# Altium schematic sheet MCU.SchDoc
size A3; DocumentNumber: 3; SheetNumber: 1; SheetTotal: 5
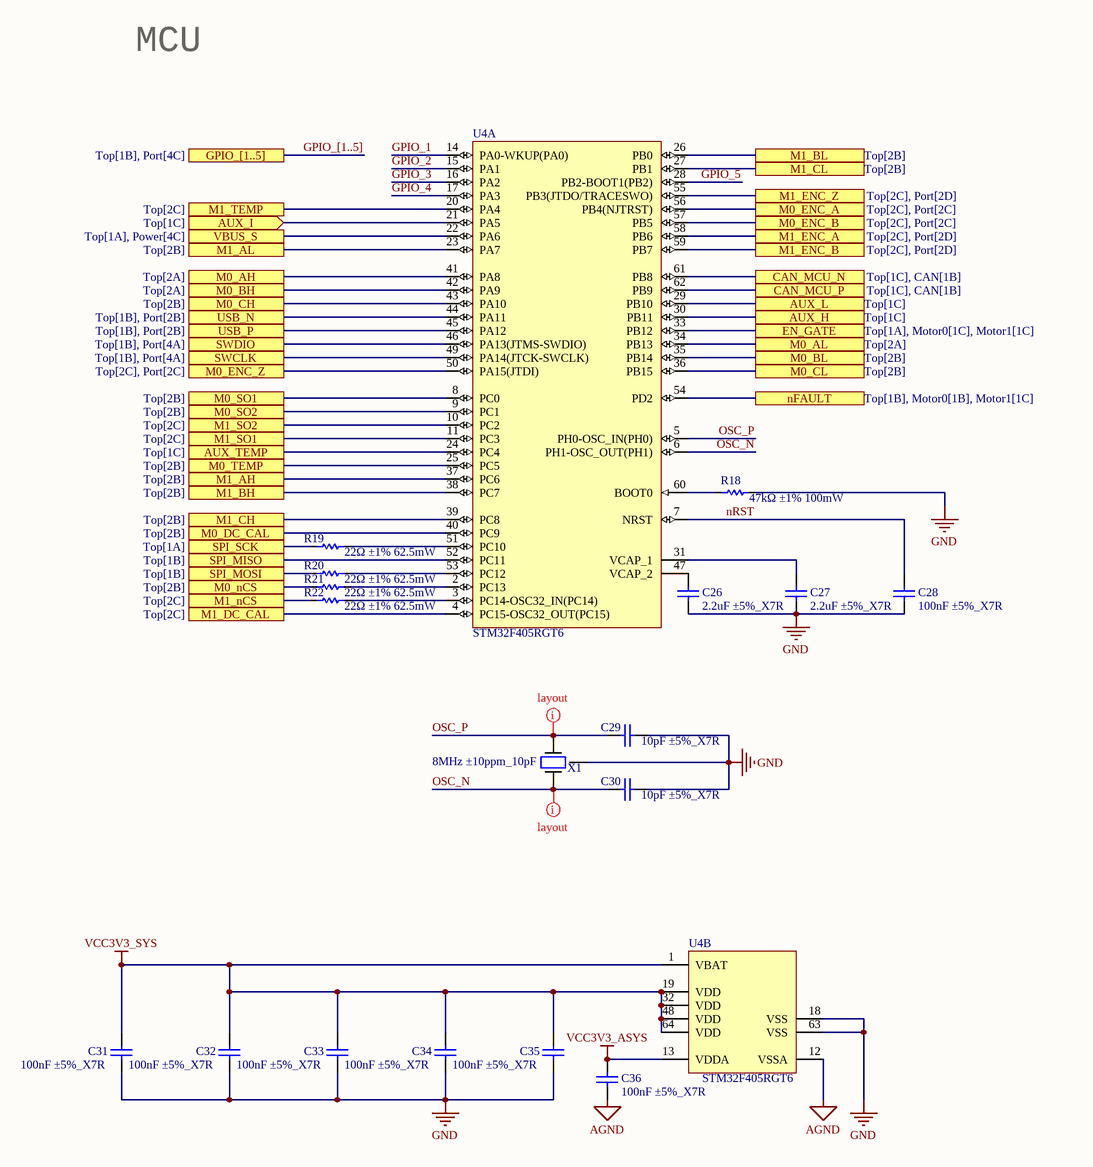
[diagram p0: MCU.SchDoc]

## Parts
C26  2.2uF ±5%_X7R  [C0603]
C27  2.2uF ±5%_X7R  [C0603]
C28  100nF ±5%_X7R  [C0402]
C29  10pF ±5%_X7R  [C0402]
C30  10pF ±5%_X7R  [C0402]
C31  100nF ±5%_X7R  [C0402]
C32  100nF ±5%_X7R  [C0402]
C33  100nF ±5%_X7R  [C0402]
C34  100nF ±5%_X7R  [C0402]
C35  100nF ±5%_X7R  [C0402]
C36  100nF ±5%_X7R  [C0402]
R18  47kΩ ±1% 100mW  [R0402]
R19  22Ω ±1% 62.5mW  [R0402]
R20  22Ω ±1% 62.5mW  [R0402]
R21  22Ω ±1% 62.5mW  [R0402]
R22  22Ω ±1% 62.5mW  [R0402]
U4  STM32F405RGT6  [STM-LQFP64_N]  (parts A,B of 2)
X1  8MHz ±10ppm_10pF  [CRYSTAL_3225]

## Ports
AUX_H (see Top[1C]), AUX_I (in, see Top[1C]), AUX_L (see Top[1C]), AUX_TEMP (see Top[1C]), CAN_MCU_N (see Top[1C], CAN[1B]), CAN_MCU_P (see Top[1C], CAN[1B]), EN_GATE (see Top[1A], Motor0[1C], Motor1[1C]), GPIO_[1..5] (see Top[1B], Port[4C]), M0_AH (see Top[2A]), M0_AL (see Top[2A]), M0_BH (see Top[2A]), M0_BL (see Top[2B]), M0_CH (see Top[2B]), M0_CL (see Top[2B]), M0_DC_CAL (see Top[2B]), M0_ENC_A (see Top[2C], Port[2C]), M0_ENC_B (see Top[2C], Port[2C]), M0_ENC_Z (see Top[2C], Port[2C]), M0_nCS (see Top[2B]), M0_SO1 (see Top[2B]), M0_SO2 (see Top[2B]), M0_TEMP (see Top[2B]), M1_AH (see Top[2B]), M1_AL (see Top[2B]), M1_BH (see Top[2B]), M1_BL (see Top[2B]), M1_CH (see Top[2B]), M1_CL (see Top[2B]), M1_DC_CAL (see Top[2C]), M1_ENC_A (see Top[2C], Port[2D]), M1_ENC_B (see Top[2C], Port[2D]), M1_ENC_Z (see Top[2C], Port[2D]), M1_nCS (see Top[2C]), M1_SO1 (see Top[2C]), M1_SO2 (see Top[2C]), M1_TEMP (see Top[2C]), nFAULT (see Top[1B], Motor0[1B], Motor1[1C]), SPI_MISO (see Top[1B]), SPI_MOSI (see Top[1B]), SPI_SCK (see Top[1A]), SWCLK (see Top[1B], Port[4A]), SWDIO (see Top[1B], Port[4A]), USB_N (see Top[1B], Port[2B]), USB_P (see Top[1B], Port[2B]), VBUS_S (see Top[1A], Power[4C])

## Nets
AGND: C36.1 U4.12(VSSA)
GND: C26.1 C27.1 C28.1 C29.2 C30.2 C31.1 C32.1 C33.1 C34.1 C35.1 R18.2 U4.18(VSS) U4.63(VSS) X1.G
VCC3V3_ASYS: C36.2 U4.13(VDDA)
VCC3V3_SYS: C31.2 C32.2 C33.2 C34.2 C35.2 U4.1(VBAT) U4.19(VDD) U4.32(VDD) U4.48(VDD) U4.64(VDD)
AUX_H: U4.30(PB11) ; port AUX_H
AUX_I: U4.21(PA5) ; port AUX_I
AUX_L: U4.29(PB10) ; port AUX_L
AUX_TEMP: U4.24(PC4) ; port AUX_TEMP
CAN_MCU_N: U4.61(PB8) ; port CAN_MCU_N
CAN_MCU_P: U4.62(PB9) ; port CAN_MCU_P
EN_GATE: U4.33(PB12) ; port EN_GATE
GPIO_1: U4.14(PA0-WKUP(PA0))
GPIO_2: U4.15(PA1)
GPIO_3: U4.16(PA2)
GPIO_4: U4.17(PA3)
GPIO_5: U4.28(PB2-BOOT1(PB2))
M0_AH: U4.41(PA8) ; port M0_AH
M0_AL: U4.34(PB13) ; port M0_AL
M0_BH: U4.42(PA9) ; port M0_BH
M0_BL: U4.35(PB14) ; port M0_BL
M0_CH: U4.43(PA10) ; port M0_CH
M0_CL: U4.36(PB15) ; port M0_CL
M0_DC_CAL: U4.40(PC9) ; port M0_DC_CAL
M0_ENC_A: U4.56(PB4(NJTRST)) ; port M0_ENC_A
M0_ENC_B: U4.57(PB5) ; port M0_ENC_B
M0_ENC_Z: U4.50(PA15(JTDI)) ; port M0_ENC_Z
M0_nCS: R21.1 ; port M0_nCS
M0_SO1: U4.8(PC0) ; port M0_SO1
M0_SO2: U4.9(PC1) ; port M0_SO2
M0_TEMP: U4.25(PC5) ; port M0_TEMP
M1_AH: U4.37(PC6) ; port M1_AH
M1_AL: U4.23(PA7) ; port M1_AL
M1_BH: U4.38(PC7) ; port M1_BH
M1_BL: U4.26(PB0) ; port M1_BL
M1_CH: U4.39(PC8) ; port M1_CH
M1_CL: U4.27(PB1) ; port M1_CL
M1_DC_CAL: U4.4(PC15-OSC32_OUT(PC15)) ; port M1_DC_CAL
M1_ENC_A: U4.58(PB6) ; port M1_ENC_A
M1_ENC_B: U4.59(PB7) ; port M1_ENC_B
M1_ENC_Z: U4.55(PB3(JTDO/TRACESWO)) ; port M1_ENC_Z
M1_nCS: R22.1 ; port M1_nCS
M1_SO1: U4.11(PC3) ; port M1_SO1
M1_SO2: U4.10(PC2) ; port M1_SO2
M1_TEMP: U4.20(PA4) ; port M1_TEMP
nFAULT: U4.54(PD2) ; port nFAULT
nRST: C28.2 U4.7(NRST)
OSC_N: C30.1 U4.6(PH1-OSC_OUT(PH1)) X1.1
OSC_P: C29.1 U4.5(PH0-OSC_IN(PH0)) X1.3
SPI_MISO: U4.52(PC11) ; port SPI_MISO
SPI_MOSI: R20.1 ; port SPI_MOSI
SPI_SCK: R19.1 ; port SPI_SCK
SWCLK: U4.49(PA14(JTCK-SWCLK)) ; port SWCLK
SWDIO: U4.46(PA13(JTMS-SWDIO)) ; port SWDIO
USB_N: U4.44(PA11) ; port USB_N
USB_P: U4.45(PA12) ; port USB_P
VBUS_S: U4.22(PA6) ; port VBUS_S
NetC26_2: C26.2 U4.47(VCAP_2)
NetC27_2: C27.2 U4.31(VCAP_1)
NetR18_1: R18.1 U4.60(BOOT0)
NetR19_2: R19.2 U4.51(PC10)
NetR20_2: R20.2 U4.53(PC12)
NetR21_2: R21.2 U4.2(PC13)
NetR22_2: R22.2 U4.3(PC14-OSC32_IN(PC14))

## Buses and harness runs
bus GPIO_[1..5] = port GPIO_[1..5]

## Layout directives
mark named layout: OSC_N, OSC_P

## Notes on the sheet
- MCU

## Library data of the parts
C26-C36 = Cap: Capacitor; Published: 8-Jun-2000; LatestRevisionDate: 17-Jul-2002; LatestRevisionNote: Re-released for DXP Platform.; PackageReference: RAD-0.3; Publisher: Altium Limited; PackageDescription: Radial Cap, Thru-Hole; 2 Leads; 0.3 in Pin Spacing
R18-R22 = Res: Resistor; Published: 8-Jun-2000; LatestRevisionDate: 17-Jul-2002; LatestRevisionNote: Re-released for DXP Platform.; PackageReference: AXIAL-0.3; Publisher: Altium Limited; PackageDescription: Axial Device, Thru-Hole; 2 Leads; 0.3 in Pin Spacing
U4 = STM32F405RGT6: ARM Cortex-M4 32-bit MCU+FPU, 210 DMIPS, 1024 kB Flash, 192 kB Internal RAM, 51 I/Os, 64-pin LQFP, -40 to 85 degC, Tray; Manufacturer: STMicroelectronics; D/A Converter: 2x12-bit; FLASH Size (Prog) (kB): 1024; I/Os (High Current): 51; Internal RAM Size (kB): 192; Operating Frequency(F) (Processor speed) (MHz): 168; Supply Voltage(Vcc) max (V): 3.6; Supply Voltage(Vcc) min (V): 1.8; DatasheetVersion: Rev. 4; PackageVersion: Rev. 4, 06/2013; PackageReference: LQFP64; PackageDescription: 64-Pin Low Profile Quad Flat Package, 10 x 10 mm Body, 0.5 mm Pitch; Supplier 1: Digi-Key; Supplier Part Number 1: 497-11767-ND; Supplier 2: Farnell; Supplier Part Number 2: 2064363; Supplier 3: Newark; Supplier Part Number 3: 73T2329; Supplier 4: Mouser; Supplier Part Number 4: 511-STM32F405RGT6; Core: ARM Cortex-M4; Packing: Tray; Mounting Technology: Surface Mount; PartNumber: STM32F405RGT6; ComponentLink1Description: Manufacturer URL; ComponentLink1URL: http://www.st.com/web/en/home.html; ComponentLink2Description: Datasheet; ComponentLink2URL: http://www.st.com/st-web-ui/static/active/en/resource/technical/document/datasheet/DM00037051.pdf; ComponentLink3Description: Package Specification; ComponentLink3URL: http://www.st.com/st-web-ui/static/active/en/resource/technical/document/datasheet/DM00037051.pdf
X1 = CRYSTAL: Crystal 8MHz ±10ppm 10pF 200 Ohm -10°C ~ 60°C Surface Mount 4-SMD, No Lead (DFN, LCC); Manufacturer: Abracon LLC; Manufacturer Part Number: ABM3B-8.000MHZ-10-1-U-T; Operating Mode: Fundamental; Supplier 1: Digi-Key; Supplier Part Number 1: 535-9721-1-ND; RoHS: RoHS Compliant; Category: Crystals, Oscillators, Resonators; Stock: 35437; Pricing 1: 1=0.69, 10=0.578, 50=0.5198, 100=0.462, 500=0.4389 (USD); Packaging: Cut Tape (CT); Part Status: Active; Type: MHz Crystal; Frequency Stability: ±10ppm; Frequency Tolerance: ±10ppm; Load Capacitance: 10pF; Operating Temperature: -10°C ~ 60°C; Ratings: -; Mounting Type: Surface Mount; Package / Case: 4-SMD, No Lead; Size / Dimension: 0.197" L x 0.126" W (5.00mm x 3.20mm); Height - Seated (Max): 0.043" (1.10mm); ComponentLink1URL: http://www.abracon.com/Resonators/abm3b.pdf; ComponentLink1Description: http://www.abracon.com/Resonators/abm3b.pdf; Supplier 2: Digi-Key; Supplier Part Number 2: 535-9721-2-ND; Pricing 2: 1000=0.336, 3000=0.315, 5000=0.3045, 10000=0.294 (USD)